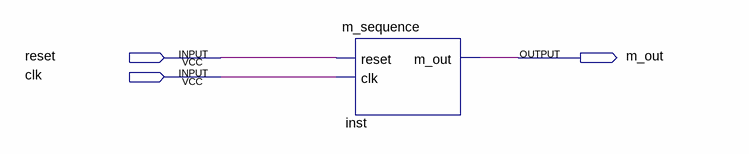
[diagram p0: schematic sheet]
// Quartus schematic m_fangzhen.bdf as structural Verilog: 1 symbols, 3 pins
module m_fangzhen (
  input  reset,
  input  clk,
  output m_out
);

  m_sequence inst (.reset(reset), .clk(clk), .m_out(m_out));
endmodule
